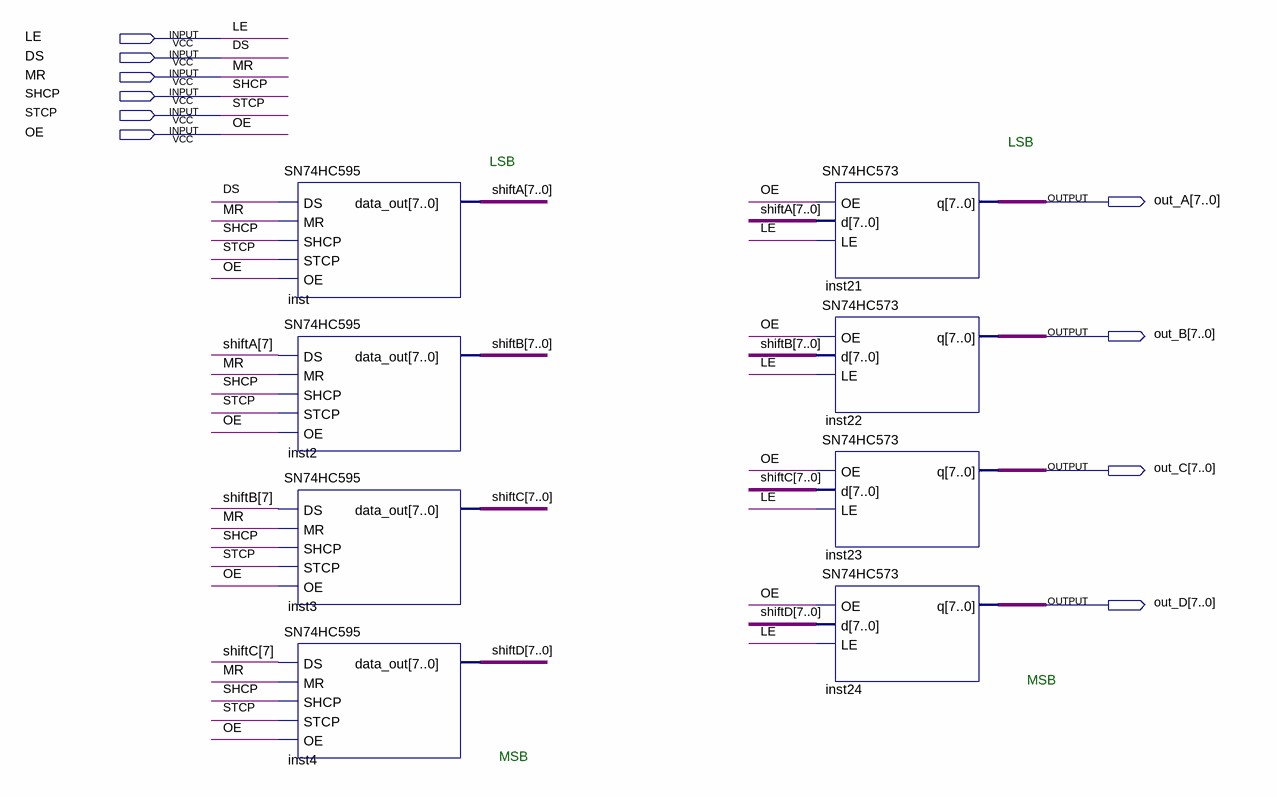
[diagram p0: schematic sheet]
// Quartus schematic led_controller_32.bdf as structural Verilog: 8 symbols, 10 pins
module led_controller_32 (
  input  LE,
  input  DS,
  input  MR,
  input  SHCP,
  input  STCP,
  input  OE,
  output [7:0] out_A,
  output [7:0] out_B,
  output [7:0] out_C,
  output [7:0] out_D
);

  wire [7:0] shiftA, shiftB, shiftC, shiftD;

  SN74HC595 inst (.DS(DS), .MR(MR), .SHCP(SHCP), .STCP(STCP), .OE(OE), .data_out(shiftA));
  SN74HC595 inst2 (.DS(shiftA[7]), .MR(MR), .SHCP(SHCP), .STCP(STCP), .OE(OE), .data_out(shiftB));
  SN74HC595 inst3 (.DS(shiftB[7]), .MR(MR), .SHCP(SHCP), .STCP(STCP), .OE(OE), .data_out(shiftC));
  SN74HC595 inst4 (.DS(shiftC[7]), .MR(MR), .SHCP(SHCP), .STCP(STCP), .OE(OE), .data_out(shiftD));
  SN74HC573 inst21 (.OE(OE), .d(shiftA), .LE(LE), .q(out_A));
  SN74HC573 inst22 (.OE(OE), .d(shiftB), .LE(LE), .q(out_B));
  SN74HC573 inst23 (.OE(OE), .d(shiftC), .LE(LE), .q(out_C));
  SN74HC573 inst24 (.OE(OE), .d(shiftD), .LE(LE), .q(out_D));

  // Notes on the sheet:
  //   LSB
  //   LSB
  //   MSB
  //   MSB
endmodule
